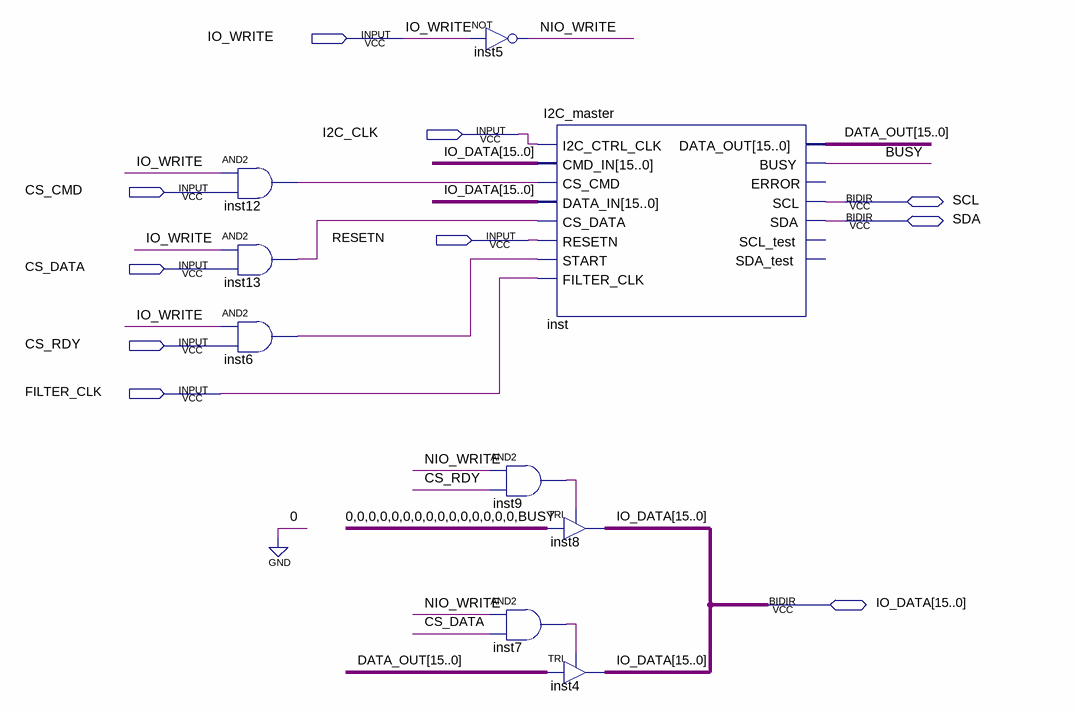
[diagram p0: schematic sheet]
// Quartus schematic I2C_INTERFACE.bdf as structural Verilog: 9 symbols, 10 pins
module I2C_INTERFACE (
  input  IO_WRITE,
  input  I2C_CLK,
  input  CS_CMD,
  input  RESETN,
  input  CS_DATA,
  input  CS_RDY,
  input  FILTER_CLK,
  inout  SCL,
  inout  SDA,
  inout  [15:0] IO_DATA
);

  wire BUSY, inst6_out, inst7_out, inst9_out, inst12_out, inst13_out, NIO_WRITE;
  wire [15:0] DATA_OUT;

  and inst12 (inst12_out, IO_WRITE, CS_CMD);
  and inst13 (inst13_out, IO_WRITE, CS_DATA);
  and inst6 (inst6_out, IO_WRITE, CS_RDY);
  not inst5 (NIO_WRITE, IO_WRITE);
  I2C_master inst (
    .I2C_CTRL_CLK(I2C_CLK), .CMD_IN(IO_DATA), .CS_CMD(inst12_out), .DATA_IN(IO_DATA), .CS_DATA(inst13_out),
    .RESETN(RESETN), .START(inst6_out), .FILTER_CLK(FILTER_CLK), .DATA_OUT(DATA_OUT), .BUSY(BUSY), .SCL(SCL),
    .SDA(SDA));  // open: ERROR, SCL_test, SDA_test
  and inst9 (inst9_out, NIO_WRITE, CS_RDY);
  TRI inst8[15:0] (.IN({{15{1'b0}}, BUSY}), .OE(inst9_out), .OUT(IO_DATA));
  and inst7 (inst7_out, NIO_WRITE, CS_DATA);
  TRI inst4[15:0] (.IN(DATA_OUT), .OE(inst7_out), .OUT(IO_DATA));
endmodule
